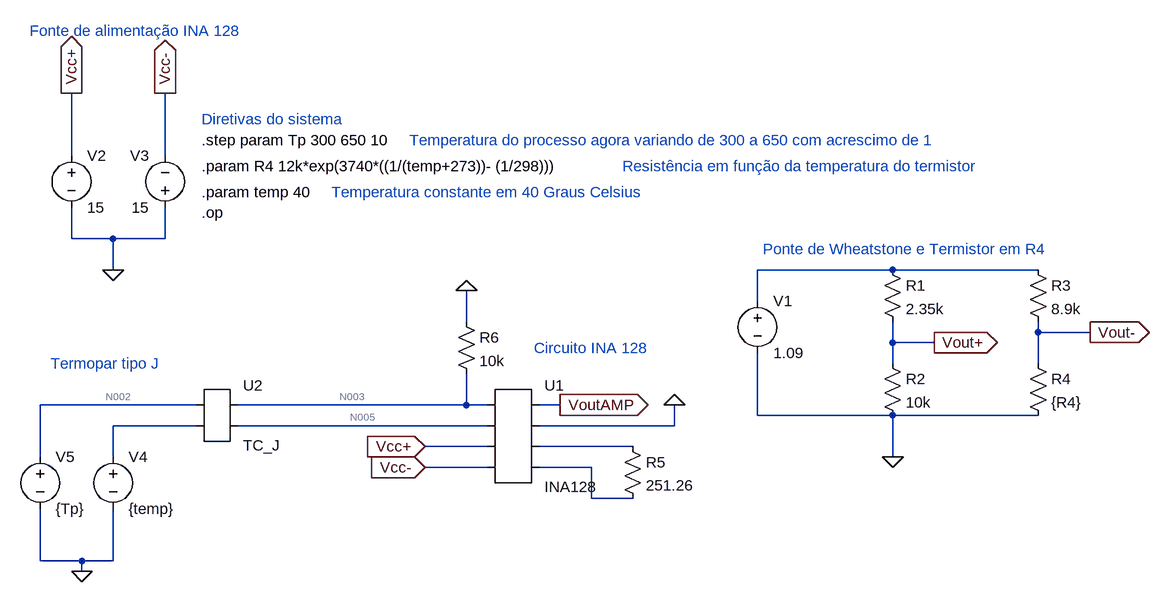
[diagram p0: schematic questãoD.asc]
* questãoD.asc
V1 N001 0 1.09
R1 N001 Vout+ 2.35k
R2 Vout+ 0 10k
R3 N001 Vout- 8.9k
R4 Vout- 0 {R4}
V2 Vcc+ 0 15
V3 0 Vcc- 15
* U2: TC_J (symbol AutoGenerated\TC_J not available, pins judged from their places): pin1=N002 pin2=N004 pin3=N003 pin4=N005
R5 N006 N007 251.26
R6 0 N003 10k
V4 N004 0 {temp}
V5 N002 0 {Tp}
* U1: INA128 (symbol AutoGenerated\INA128 not available, pins judged from their places): pin1=N003 pin2=N005 pin3=Vcc+ pin4=Vcc- pin5=VoutAMP pin6=0 pin7=N006 pin8=N007
.param R4 12k*exp(3740*((1/(temp+273))- (1/298)))
.param temp 40
.op
* Ponte de Wheatstone e Termistor em R4
* Fonte de alimentação INA 128
* Diretivas do sistema
* Resistência em função da temperatura do termistor
* Temperatura constante em 40 Graus Celsius
.step param Tp 300 650 10
* Temperatura do processo agora variando de 300 a 650 com acrescimo de 1
* Circuito INA 128
* Termopar tipo J
.backanno
.end

* Results of the author's LTspice run, read from the files saved beside the schematic
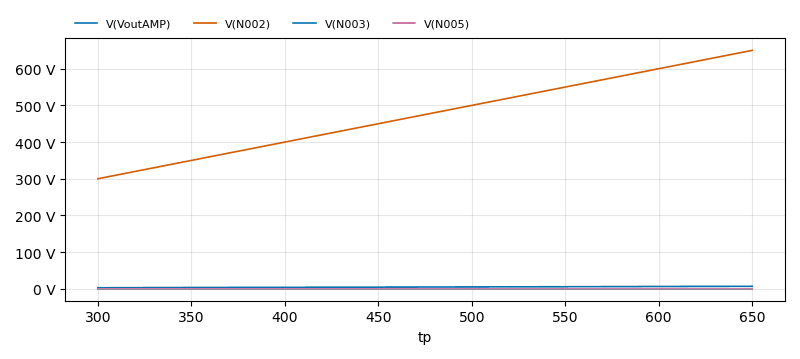
[diagram p1: Operating Point of questãoD.asc, plotted from the saved traces]
* Operating Point, 1 run:
*   V(VoutAMP): 2.853 V at tp=300 , 6.801 V at tp=650 , min 2.853 V, max 6.801 V
*   V(N002): 300 V at tp=300 , 650 V at tp=650 , min 300 V, max 650 V
*   V(N003): 230.8 nV at tp=300 , 231.4 nV at tp=650 , min 230.8 nV, max 231.4 nV
*   V(N005): -14.27 mV at tp=300 , -34.01 mV at tp=650 , min -34.01 mV, max -14.27 mV
* From the log:
*   Semiconductor Device Operating Points:
*                           --- Diodes ---
*   Name:    d:u1:i2     d:u1:i1     d:u1:2      d:u1:1     d:u1:3:q2
*   Model:    u1:dx       u1:dx       u1:dx       u1:dx      u1:3:dx
*   Id:     -1.50e-11   -1.50e-11    1.12e-18   -9.64e-19   -6.52e-13
*   Vd:     -1.50e+01   -1.50e+01    1.12e-06   -9.64e-07   -6.51e-01
*   Req:     1.00e+12    1.00e+12    1.00e+12    1.00e+12    1.00e+12
*   CAP:     0.00e+00    0.00e+00    0.00e+00    0.00e+00    0.00e+00
*   Name:   d:u1:3:q1   d:u1:3:p    d:u1:3:ln   d:u1:3:lp   d:u1:3:e
*   Model:   u1:3:dx     u1:3:dx     u1:3:dx     u1:3:dx     u1:3:dx
*   Id:      6.76e-05   -3.00e-11   -1.41e-11   -4.93e-12   -1.65e-11
*   Vd:      6.51e-01   -3.00e+01   -1.41e+01   -4.93e+00   -1.65e+01
*   Req:     3.83e+02    1.00e+12    1.00e+12    1.00e+12    1.00e+12
*   CAP:     0.00e+00    0.00e+00    0.00e+00    0.00e+00    0.00e+00
*   Name:   d:u1:3:c    d:u1:2:q2   d:u1:2:q1   d:u1:2:p    d:u1:2:ln
*   Model:   u1:3:dx     u1:2:dx     u1:2:dx     u1:2:dx     u1:2:dx
*   Id:     -1.06e-11   -6.38e-13    4.06e-05   -3.00e-11   -1.40e-11
*   Vd:     -1.06e+01   -6.38e-01    6.38e-01   -3.00e+01   -1.40e+01
*   Req:     1.00e+12    1.00e+12    6.36e+02    1.00e+12    1.00e+12
*   CAP:     0.00e+00    0.00e+00    0.00e+00    0.00e+00    0.00e+00
*   Name:   d:u1:2:lp   d:u1:2:e    d:u1:2:c    d:u1:1:q2   d:u1:1:q1
*   Model:   u1:2:dx     u1:2:dx     u1:2:dx     u1:1:dx     u1:1:dx
*   Id:     -1.40e-11   -1.44e-11   -1.32e-11    1.44e-04   -6.71e-13
*   Vd:     -1.40e+01   -1.44e+01   -1.32e+01    6.70e-01   -6.70e-01
*   Req:     1.00e+12    1.00e+12    1.00e+12    1.79e+02    1.00e+12
*   CAP:     0.00e+00    0.00e+00    0.00e+00    0.00e+00    0.00e+00
*   Name:   d:u1:1:p    d:u1:1:ln   d:u1:1:lp   d:u1:1:e    d:u1:1:c
*   Model:   u1:1:dx     u1:1:dx     u1:1:dx     u1:1:dx     u1:1:dx
*   Id:     -3.00e-11   -1.39e-11   -1.41e-11   -1.16e-11   -1.60e-11
*   Vd:     -3.00e+01   -1.39e+01   -1.41e+01   -1.16e+01   -1.60e+01
*   Req:     1.00e+12    1.00e+12    1.00e+12    1.00e+12    1.00e+12
*   CAP:     0.00e+00    0.00e+00    0.00e+00    0.00e+00    0.00e+00
*                           --- Bipolar Transistors ---
*   Name:    q:u1:set2   q:u1:set1    q:u1:2      q:u1:1     q:u1:3:2
*   Model:     u1:qy       u1:qy       u1:qx       u1:qx      u1:3:qx
*   Ib:       4.10e-11    4.10e-11    4.00e-08    4.00e-08    9.96e-08
*   Ic:      -2.80e-11   -2.80e-11    2.00e-05    2.00e-05    3.18e-05
*   Vbe:      1.30e+01    1.30e+01    6.19e-01    6.19e-01    6.31e-01
*   Vbc:      2.80e+01    2.80e+01   -1.33e+01   -1.33e+01   -1.46e+01
*   Vce:     -1.50e+01   -1.50e+01    1.39e+01    1.39e+01    1.52e+01
*   BetaDC:  -6.83e-01   -6.83e-01    5.00e+02    5.00e+02    3.19e+02
*   Gm:       0.00e+00    0.00e+00    7.73e-04    7.73e-04    1.23e-03
*   Rpi:      1.00e+12    1.00e+12    6.47e+05    6.47e+05    2.60e+05
*   Rx:       0.00e+00    0.00e+00    0.00e+00    0.00e+00    0.00e+00
*   Ro:       0.00e+00    0.00e+00    0.00e+00    0.00e+00    0.00e+00
*   Cbe:      0.00e+00    0.00e+00    0.00e+00    0.00e+00    0.00e+00
*   Cbc:      0.00e+00    0.00e+00    0.00e+00    0.00e+00    0.00e+00
*   Cjs:      0.00e+00    0.00e+00    0.00e+00    0.00e+00    0.00e+00
*   BetaAC:   0.00e+00    0.00e+00    5.00e+02    5.00e+02    3.19e+02
*   Cbx:      0.00e+00    0.00e+00    0.00e+00    0.00e+00    0.00e+00
*   Ft:       0.00e+00    0.00e+00    0.00e+00    0.00e+00    0.00e+00
*   Name:    q:u1:3:1
*   Model:    u1:3:qx
*   Ib:       9.96e-08
*   Ic:       3.18e-05
*   Vbe:      6.31e-01
*   Vbc:     -1.46e+01
*   Vce:      1.52e+01
*   BetaDC:   3.19e+02
*   Gm:       1.23e-03
*   Rpi:      2.60e+05
*   Rx:       0.00e+00
*   Ro:       0.00e+00
*   Cbe:      0.00e+00
*   Cbc:      0.00e+00
*   Cjs:      0.00e+00
*   BetaAC:   3.19e+02
*   Cbx:      0.00e+00
*   Ft:       0.00e+00
*                           --- JFET Transistors ---
*   Name:   j:u1:2:2    j:u1:2:1    j:u1:1:2    j:u1:1:1
*   Model:   u1:2:jx     u1:2:jx     u1:1:jx     u1:1:jx
*   Id:     -2.35e-05   -2.35e-05   -2.35e-05   -2.35e-05
*   Vgs:     9.73e-01    9.73e-01    9.73e-01    9.73e-01
*   Vds:    -2.73e+01   -2.73e+01   -2.73e+01   -2.73e+01
*   Gm:      1.72e-03    1.72e-03    1.72e-03    1.72e-03
*   Gds:     0.00e+00    0.00e+00    0.00e+00    0.00e+00
*   Cgs:     0.00e+00    0.00e+00    0.00e+00    0.00e+00
*   Cgd:     0.00e+00    0.00e+00    0.00e+00    0.00e+00